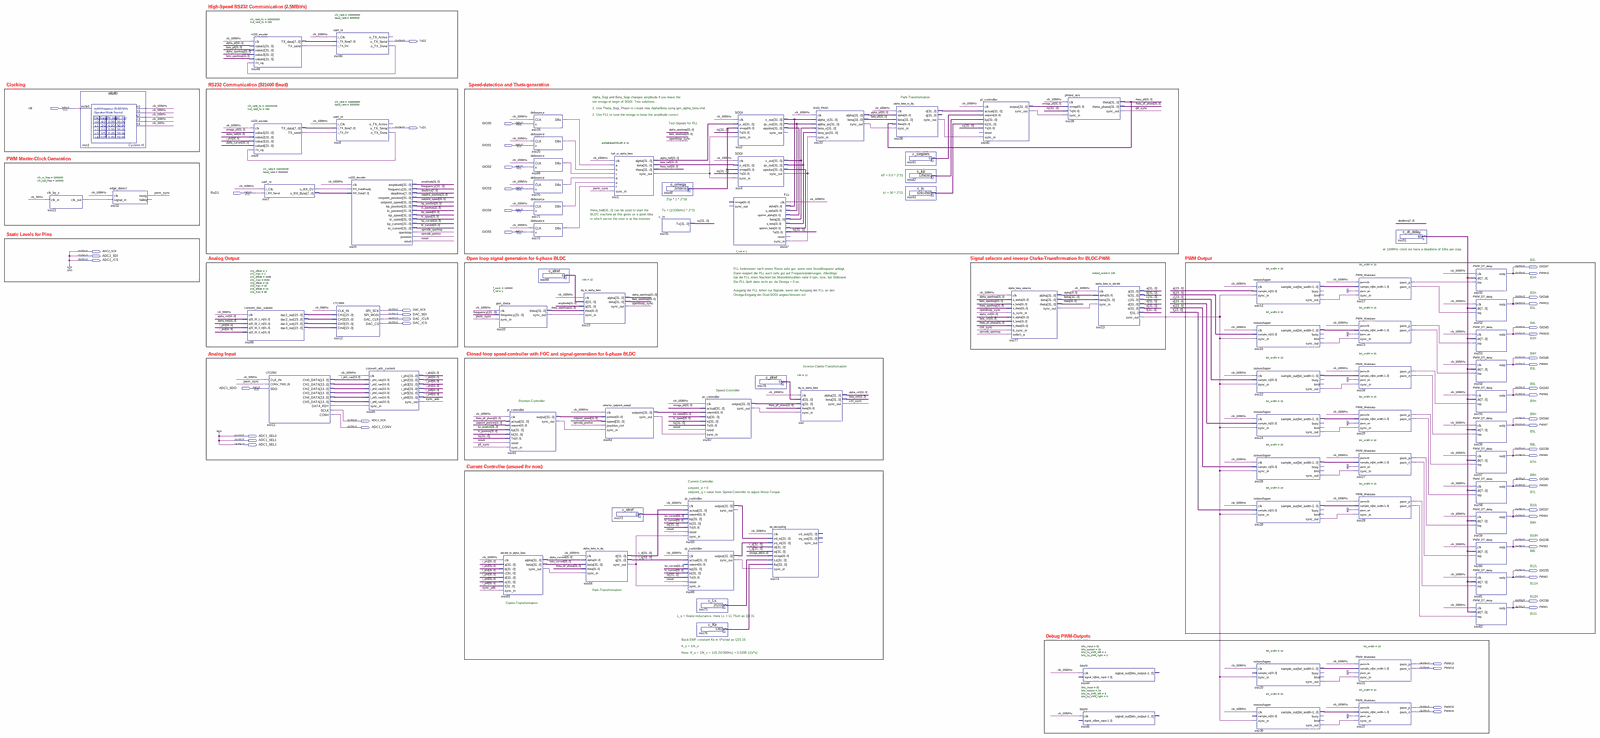
[diagram p0: schematic sheet, whole]
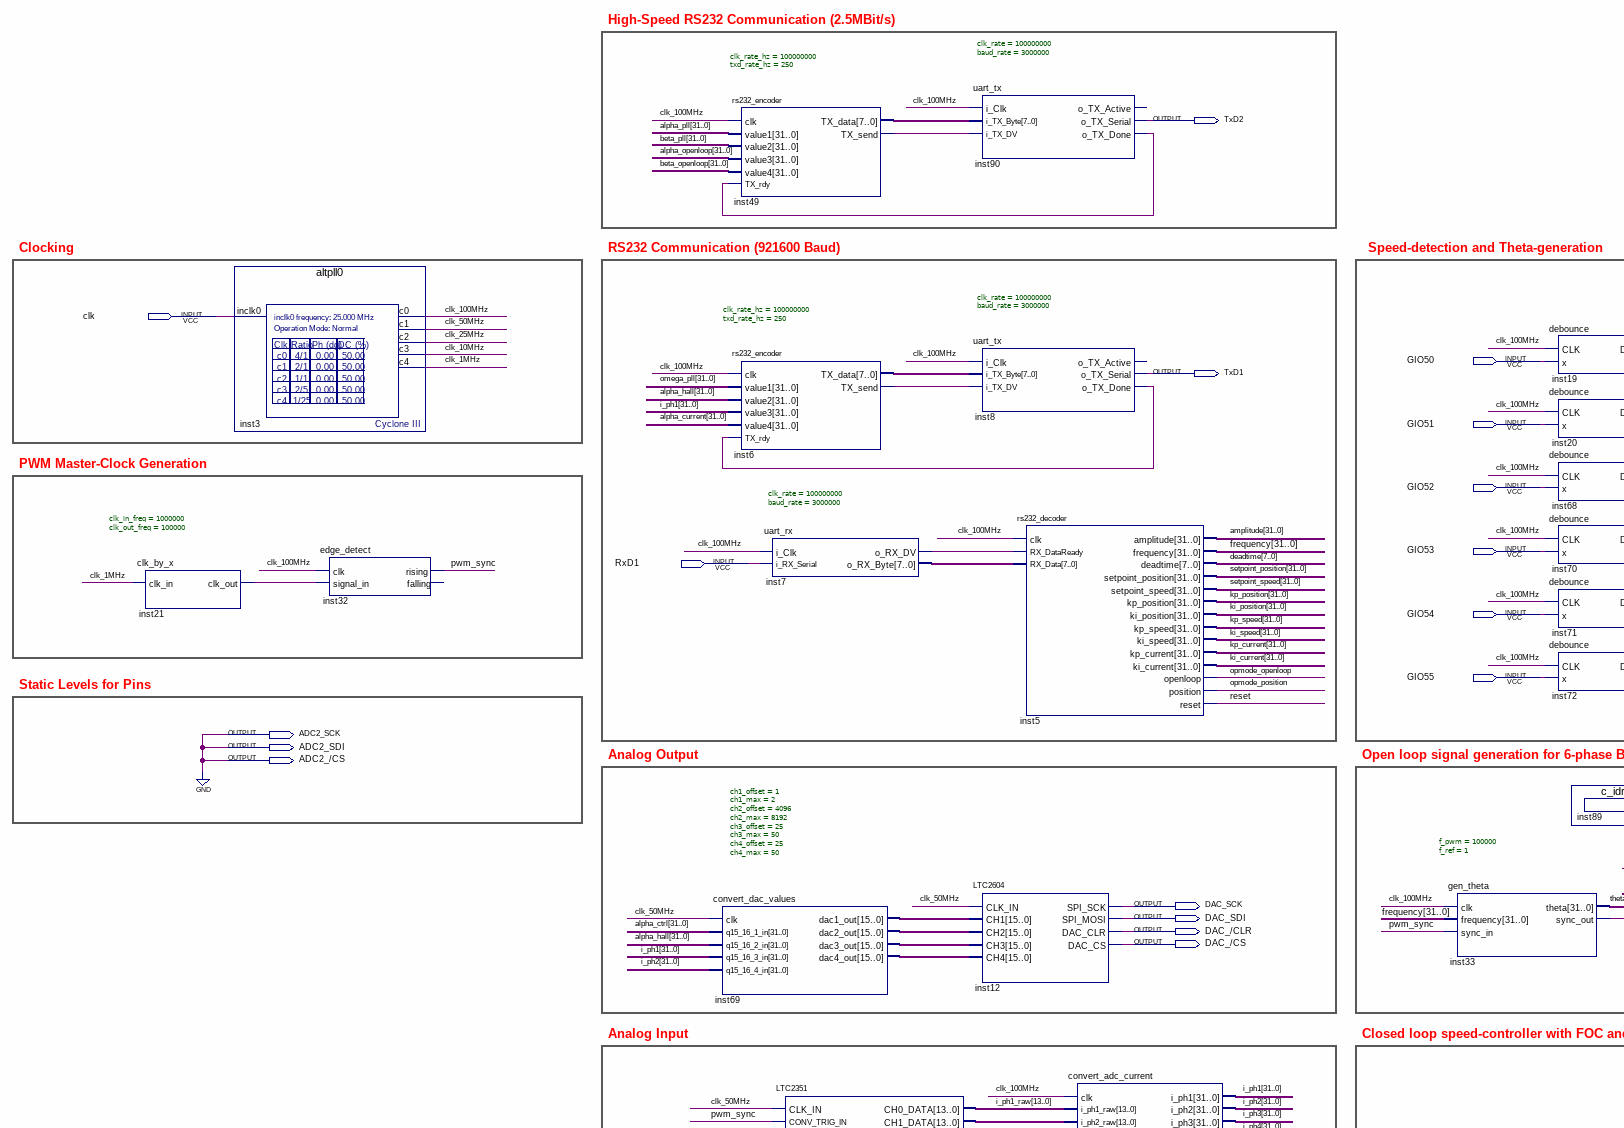
[diagram p1: schematic sheet, upper left part]
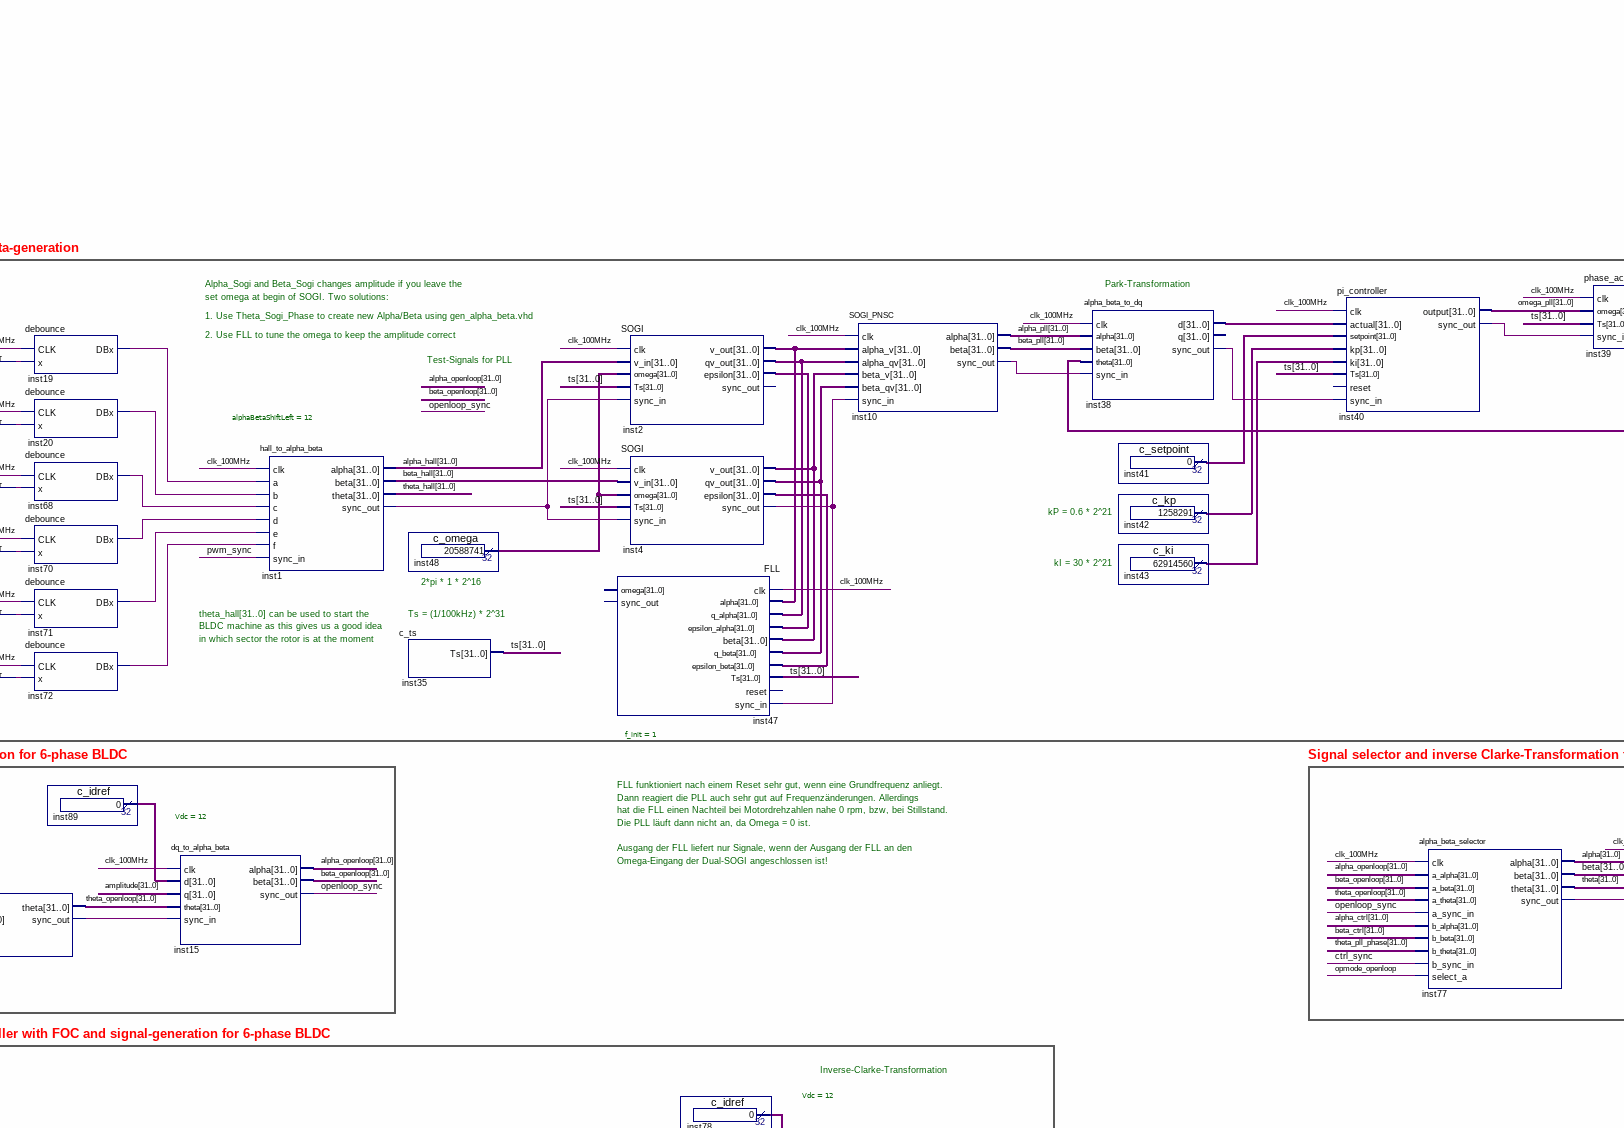
[diagram p2: schematic sheet, upper centre part]
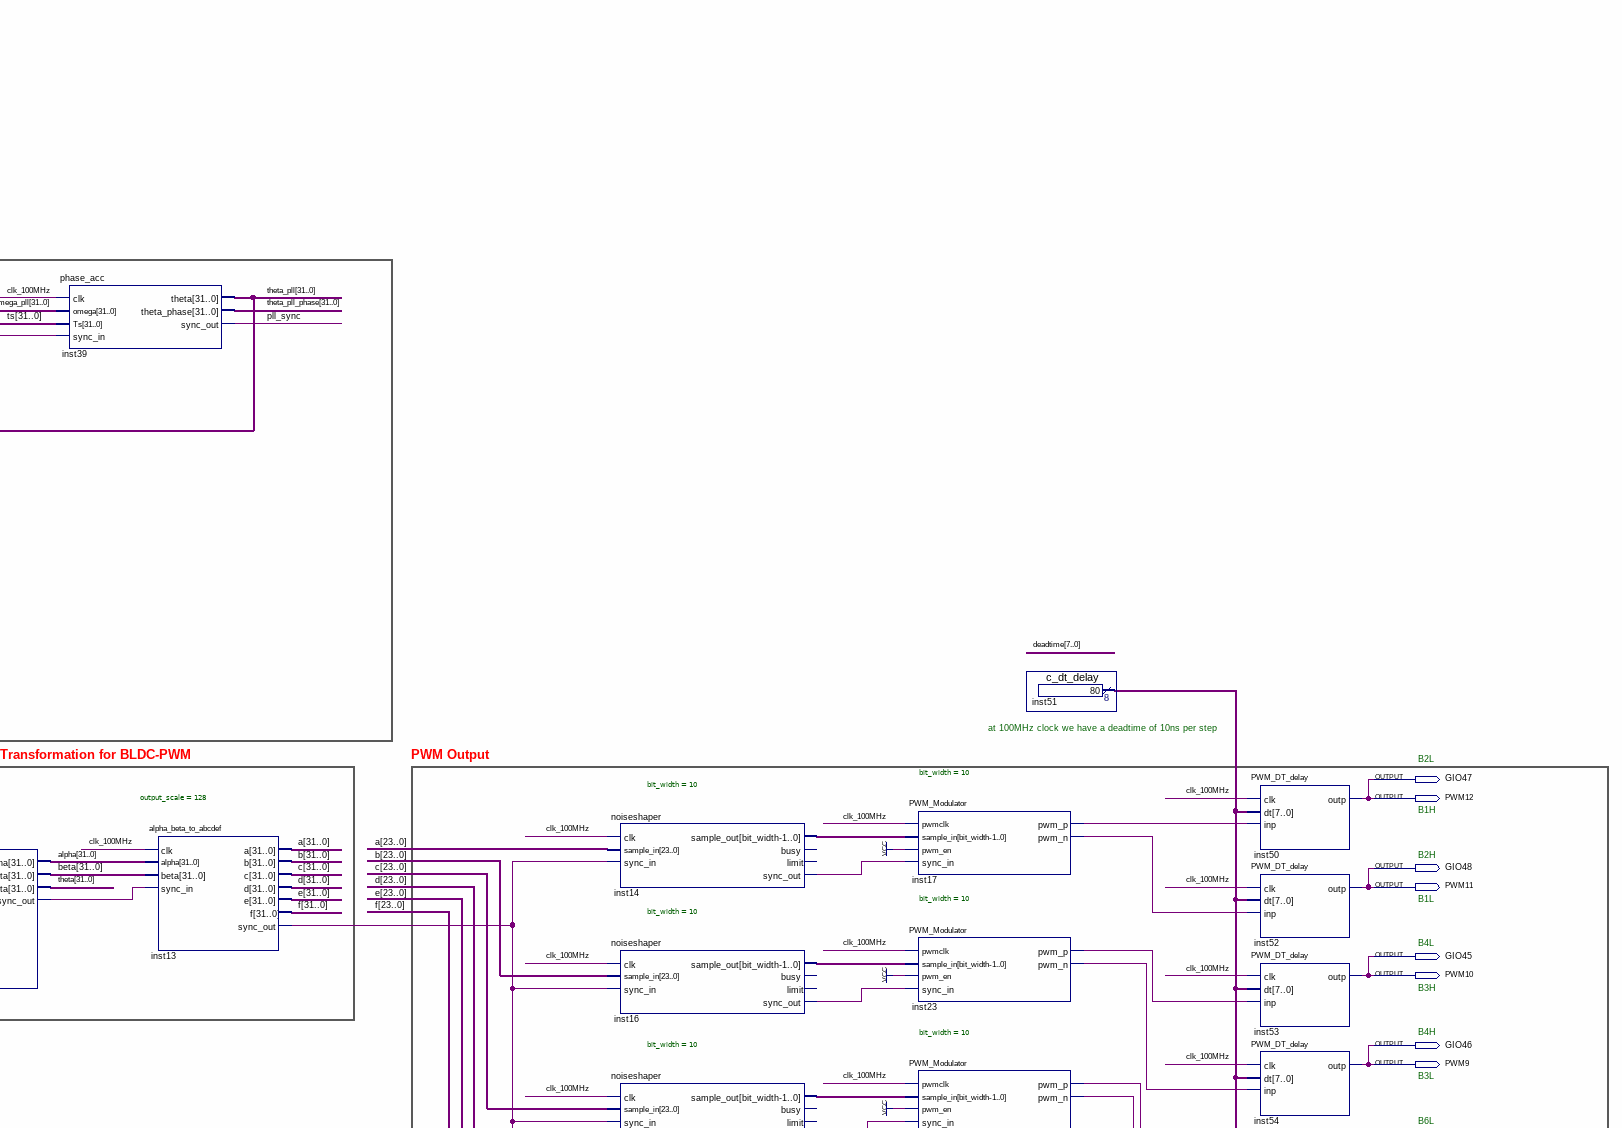
[diagram p3: schematic sheet, upper right part]
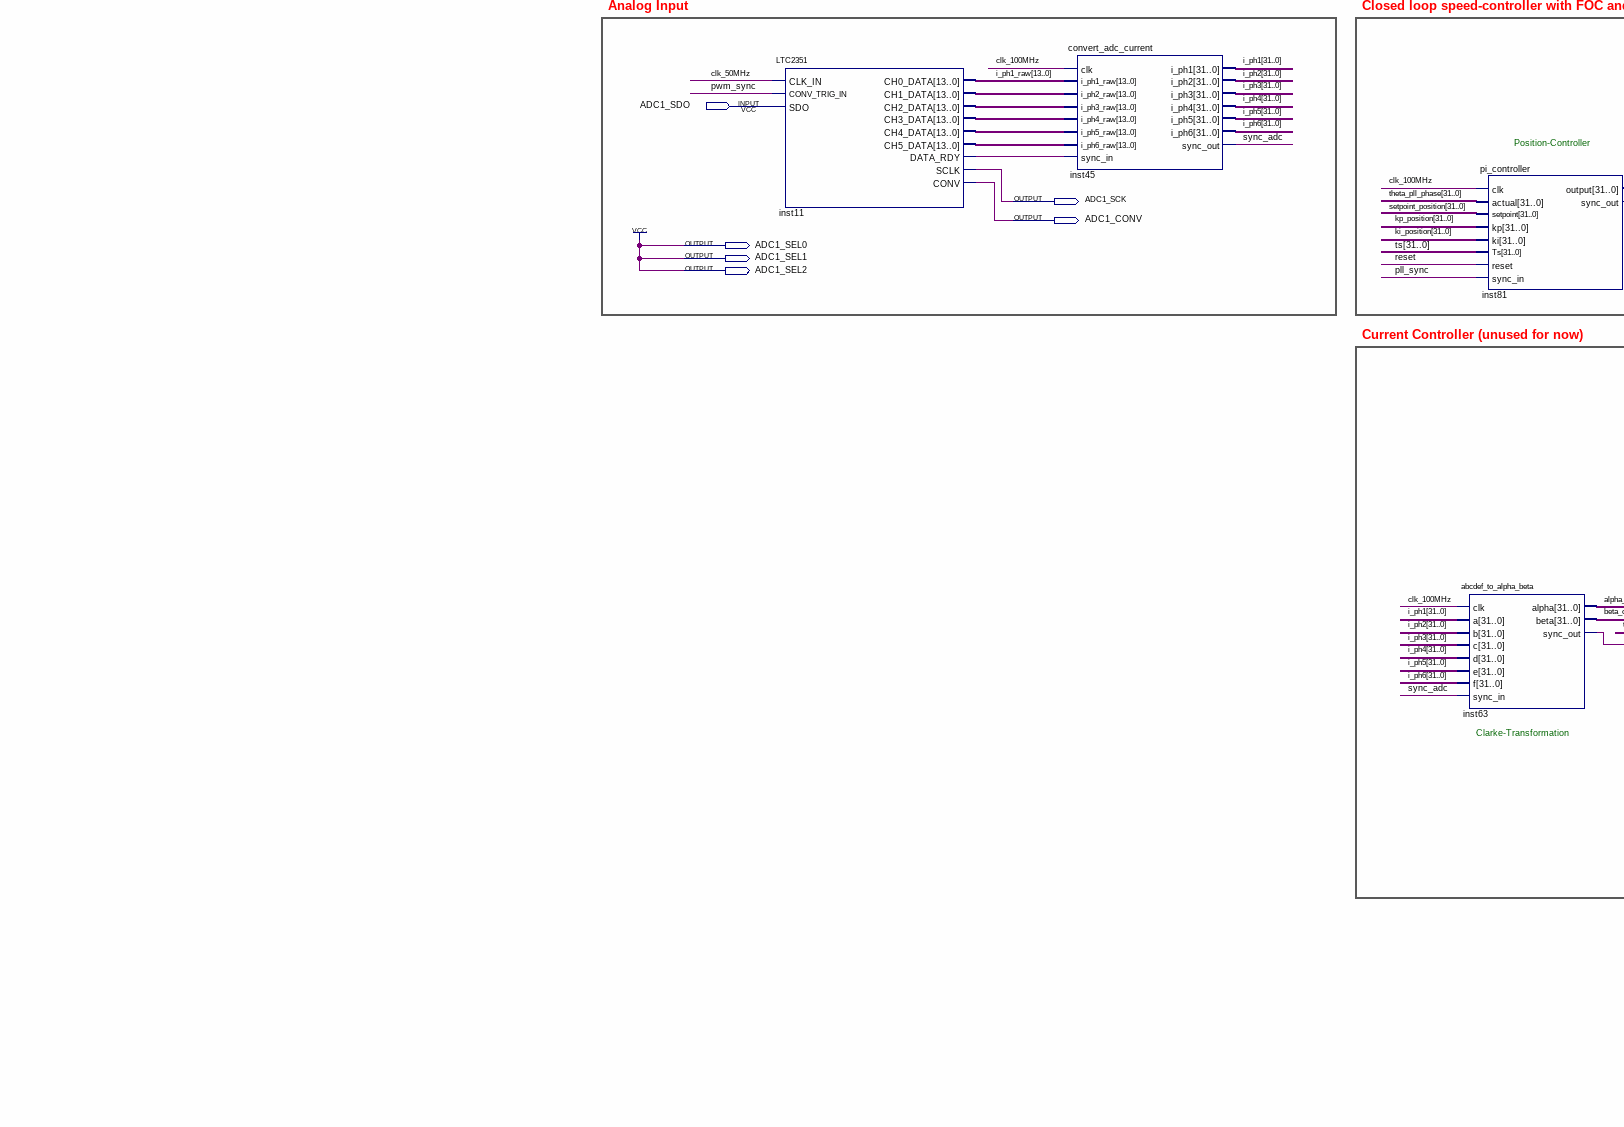
[diagram p4: schematic sheet, lower left part]
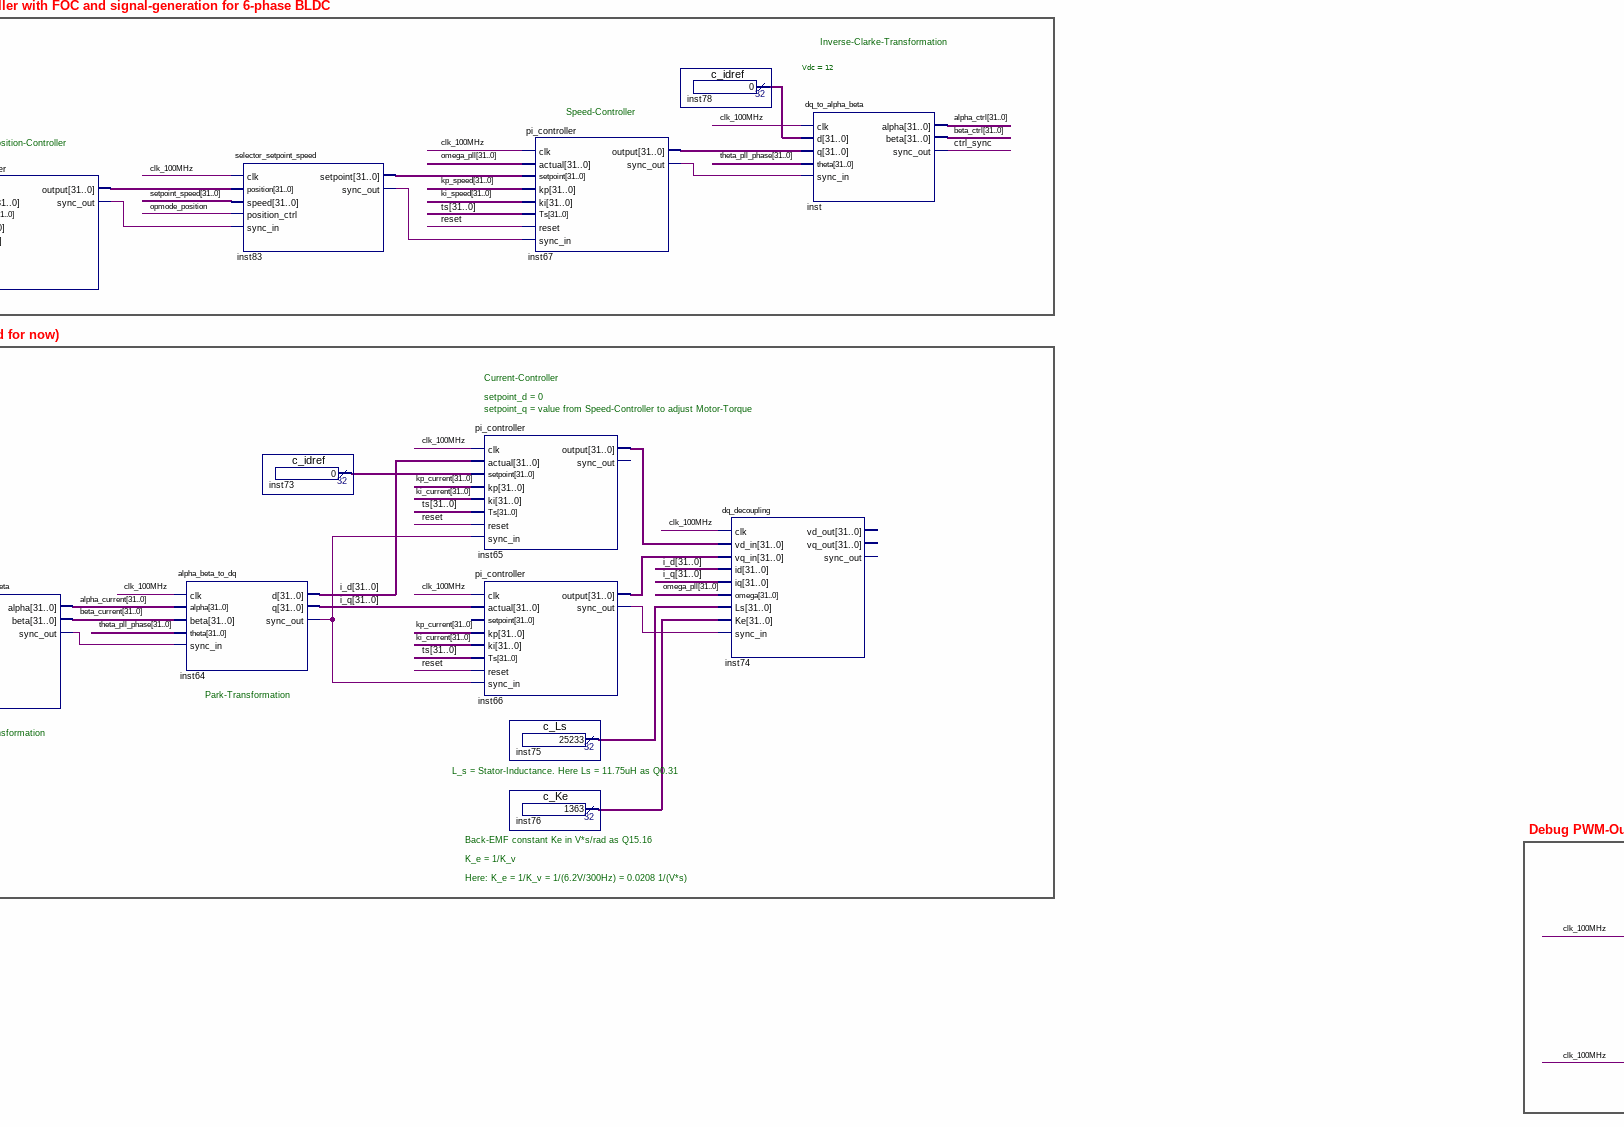
[diagram p5: schematic sheet, lower centre part]
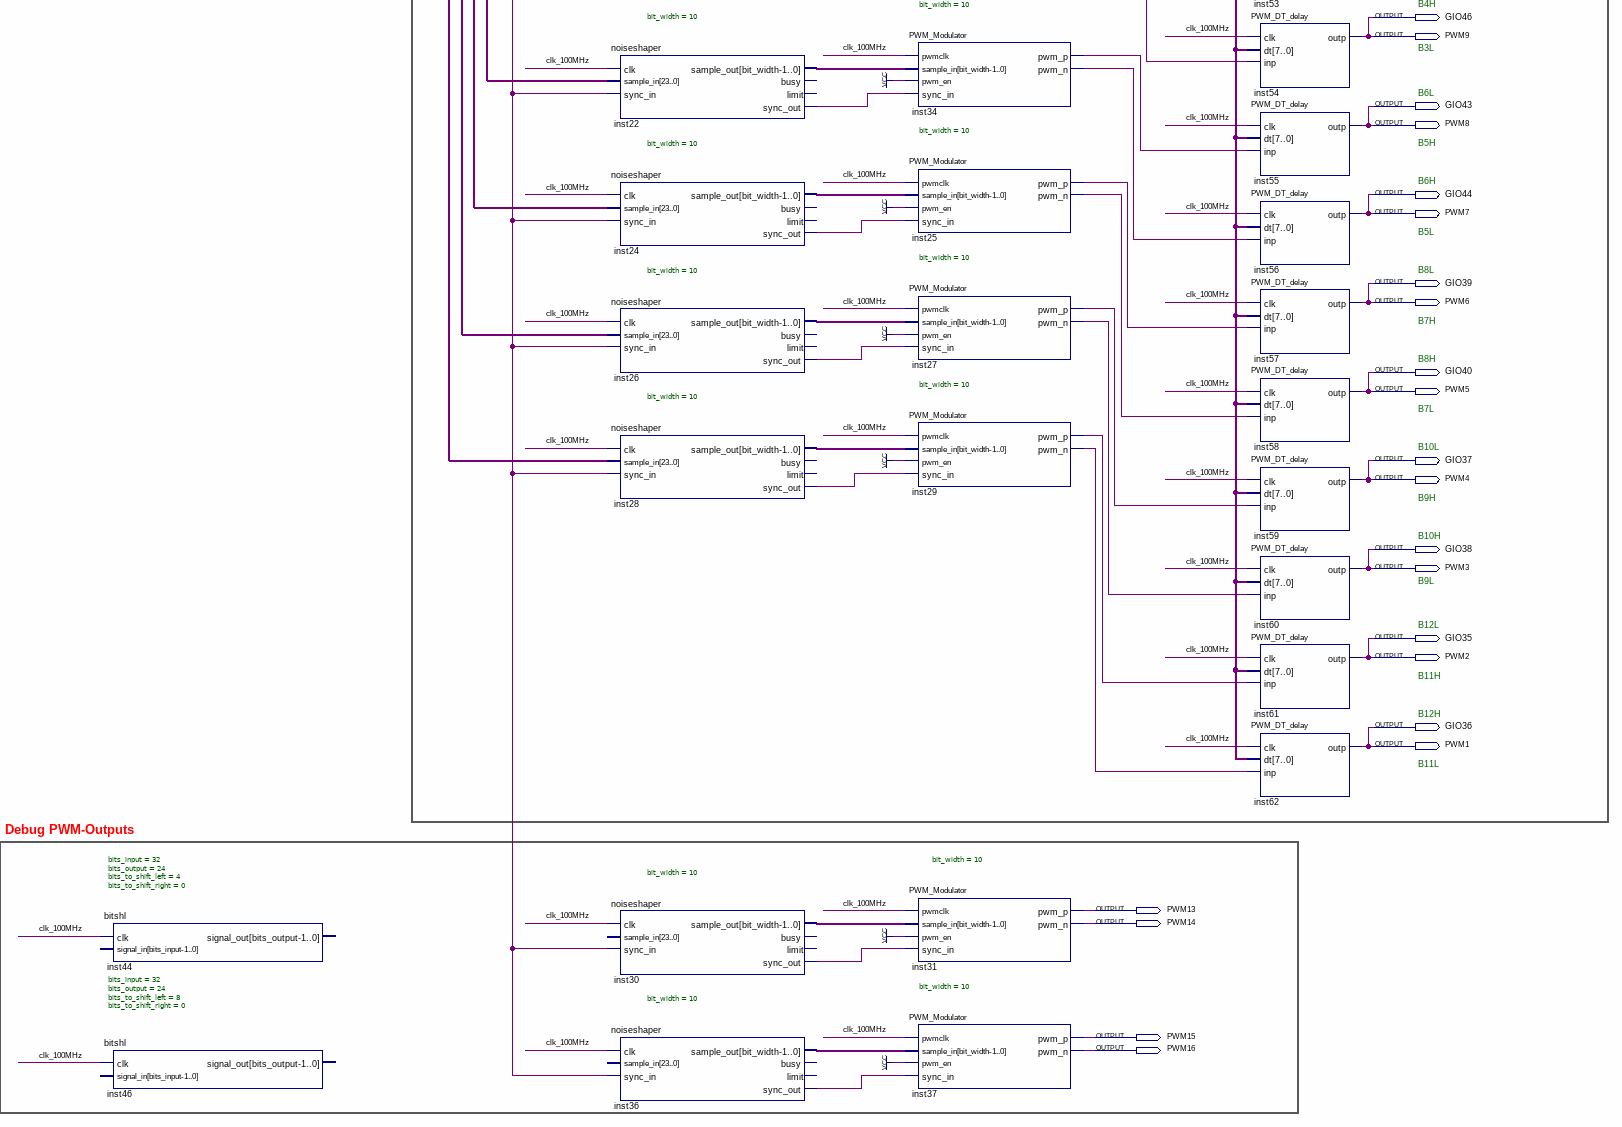
[diagram p6: schematic sheet, lower right part]
// Quartus schematic BLDC.bdf as structural Verilog: 81 symbols, 51 pins
module BLDC (
  input  clk,
  input  GIO50,
  input  GIO51,
  input  GIO52,
  input  GIO53,
  input  RxD1,
  input  GIO54,
  input  GIO55,
  input  ADC1_SDO,
  output TxD2,
  output TxD1,
  output ADC2_SCK,
  output ADC2_SDI,
  output \ADC2_/CS ,
  output GIO47,
  output PWM12,
  output GIO48,
  output PWM11,
  output DAC_SCK,
  output DAC_SDI,
  output \DAC_/CLR ,
  output \DAC_/CS ,
  output GIO45,
  output PWM10,
  output GIO46,
  output PWM9,
  output GIO43,
  output PWM8,
  output GIO44,
  output ADC1_SCK,
  output PWM7,
  output ADC1_CONV,
  output ADC1_SEL0,
  output ADC1_SEL1,
  output ADC1_SEL2,
  output GIO39,
  output PWM6,
  output GIO40,
  output PWM5,
  output GIO37,
  output PWM4,
  output GIO38,
  output PWM3,
  output GIO35,
  output PWM2,
  output GIO36,
  output PWM1,
  output PWM13,
  output PWM14,
  output PWM15,
  output PWM16
);

  wire clk_1MHz, clk_10MHz, clk_25MHz, clk_50MHz, clk_100MHz, ctrl_sync, inst1_sync_out, inst4_sync_out,
       inst6_tx_send, inst7_o_rx_dv, inst8_o_tx_done, inst10_sync_out, inst11_data_rdy, inst13_sync_out,
       inst14_sync_out, inst16_sync_out, inst17_pwm_n, inst17_pwm_p, inst19_dbx, inst20_dbx, inst21_clk_out,
       inst22_sync_out, inst23_pwm_n, inst23_pwm_p, inst24_sync_out, inst25_pwm_n, inst25_pwm_p,
       inst26_sync_out, inst27_pwm_n, inst27_pwm_p, inst28_sync_out, inst29_pwm_n, inst29_pwm_p,
       inst30_sync_out, inst33_sync_out, inst34_pwm_n, inst34_pwm_p, inst36_sync_out, inst38_sync_out,
       inst40_sync_out, inst49_tx_send, inst63_sync_out, inst64_sync_out, inst66_sync_out, inst67_sync_out,
       inst68_dbx, inst70_dbx, inst71_dbx, inst72_dbx, inst77_sync_out, inst81_sync_out, inst83_sync_out,
       inst90_o_tx_done, openloop_sync, opmode_openloop, opmode_position, pll_sync, pwm_sync, reset, sync_adc;
  wire [7:0] deadtime, inst6_tx_data, inst7_o_rx_byte, inst49_tx_data, inst51_result;
  wire [9:0] inst14_sample_out, inst16_sample_out, inst22_sample_out, inst24_sample_out, inst26_sample_out,
       inst28_sample_out, inst30_sample_out, inst36_sample_out;
  wire [13:0] i_ph1_raw, inst11_ch1_data, inst11_ch2_data, inst11_ch3_data, inst11_ch4_data, inst11_ch5_data;
  wire [15:0] inst69_dac1_out, inst69_dac2_out, inst69_dac3_out, inst69_dac4_out;
  wire [31:0] a, alpha, alpha_ctrl, alpha_current, alpha_hall, alpha_openloop, alpha_pll, amplitude, b, beta,
       beta_ctrl, beta_current, beta_hall, beta_openloop, beta_pll, c, d, e, f, frequency, i_d, i_ph1, i_ph2,
       i_ph3, i_ph4, i_ph5, i_ph6, i_q, inst2_epsilon, inst2_qv_out, inst2_v_out, inst4_epsilon,
       inst4_qv_out, inst4_v_out, inst38_d, inst41_result, inst42_result, inst43_result, inst48_result,
       inst65_output, inst66_output, inst67_output, inst73_result, inst75_result, inst76_result,
       inst78_result, inst81_output, inst83_setpoint, inst89_result, ki_current, ki_position, ki_speed,
       kp_current, kp_position, kp_speed, omega_pll, setpoint_position, setpoint_speed, theta, theta_hall,
       theta_openloop, theta_pll, theta_pll_phase, ts;

  clk_by_x #(.clk_in_freq(1000000), .clk_out_freq(100000)) inst21 (.clk_in(clk_1MHz), .clk_out(inst21_clk_out));
  altpll0 inst3 (.inclk0(clk), .c0(clk_100MHz), .c1(clk_50MHz), .c2(clk_25MHz), .c3(clk_10MHz), .c4(clk_1MHz));
  edge_detect inst32 (.clk(clk_100MHz), .signal_in(inst21_clk_out), .rising(pwm_sync));  // open: falling
  rs232_encoder #(.clk_rate_hz(100000000), .txd_rate_hz(250)) inst49 (
    .clk(clk_100MHz), .value1(alpha_pll), .value2(beta_pll), .value3(alpha_openloop), .value4(beta_openloop),
    .TX_rdy(inst90_o_tx_done), .TX_data(inst49_tx_data), .TX_send(inst49_tx_send));
  rs232_encoder #(.clk_rate_hz(100000000), .txd_rate_hz(250)) inst6 (
    .clk(clk_100MHz), .value1(omega_pll), .value2(alpha_hall), .value3(i_ph1), .value4(alpha_current),
    .TX_rdy(inst8_o_tx_done), .TX_data(inst6_tx_data), .TX_send(inst6_tx_send));
  convert_dac_values #(.ch1_offset(1), .ch1_max(2), .ch2_offset(4096), .ch2_max(8192), .ch3_offset(25), .ch3_max(50), .ch4_offset(25), .ch4_max(50)) inst69 (
    .clk(clk_50MHz), .q15_16_1_in(alpha_ctrl), .q15_16_2_in(alpha_hall), .q15_16_3_in(i_ph1),
    .q15_16_4_in(i_ph2), .dac1_out(inst69_dac1_out), .dac2_out(inst69_dac2_out), .dac3_out(inst69_dac3_out),
    .dac4_out(inst69_dac4_out));
  uart_rx #(.clk_rate(100000000), .baud_rate(3000000)) inst7 (
    .i_Clk(clk_100MHz), .i_RX_Serial(RxD1), .o_RX_DV(inst7_o_rx_dv), .o_RX_Byte(inst7_o_rx_byte));
  LTC2351 inst11 (
    .CLK_IN(clk_50MHz), .CONV_TRIG_IN(pwm_sync), .SDO(ADC1_SDO), .CH0_DATA(i_ph1_raw),
    .CH1_DATA(inst11_ch1_data), .CH2_DATA(inst11_ch2_data), .CH3_DATA(inst11_ch3_data),
    .CH4_DATA(inst11_ch4_data), .CH5_DATA(inst11_ch5_data), .DATA_RDY(inst11_data_rdy), .SCLK(ADC1_SCK),
    .CONV(ADC1_CONV));
  uart_tx #(.clk_rate(100000000), .baud_rate(3000000)) inst90 (
    .i_Clk(clk_100MHz), .i_TX_Byte(inst49_tx_data), .i_TX_DV(inst49_tx_send), .o_TX_Serial(TxD2),
    .o_TX_Done(inst90_o_tx_done));  // open: o_TX_Active
  uart_tx #(.clk_rate(100000000), .baud_rate(3000000)) inst8 (
    .i_Clk(clk_100MHz), .i_TX_Byte(inst6_tx_data), .i_TX_DV(inst6_tx_send), .o_TX_Serial(TxD1),
    .o_TX_Done(inst8_o_tx_done));  // open: o_TX_Active
  LTC2604 inst12 (
    .CLK_IN(clk_50MHz), .CH1(inst69_dac1_out), .CH2(inst69_dac2_out), .CH3(inst69_dac3_out),
    .CH4(inst69_dac4_out), .SPI_SCK(DAC_SCK), .SPI_MOSI(DAC_SDI), .DAC_CLR(\DAC_/CLR ), .DAC_CS(\DAC_/CS ));
  rs232_decoder inst5 (
    .clk(clk_100MHz), .RX_DataReady(inst7_o_rx_dv), .RX_Data(inst7_o_rx_byte), .amplitude(amplitude),
    .frequency(frequency), .deadtime(deadtime), .setpoint_position(setpoint_position),
    .setpoint_speed(setpoint_speed), .kp_position(kp_position), .ki_position(ki_position),
    .kp_speed(kp_speed), .ki_speed(ki_speed), .kp_current(kp_current), .ki_current(ki_current),
    .openloop(opmode_openloop), .position(opmode_position), .reset(reset));
  convert_adc_current inst45 (
    .clk(clk_100MHz), .i_ph1_raw(i_ph1_raw), .i_ph2_raw(inst11_ch1_data), .i_ph3_raw(inst11_ch2_data),
    .i_ph4_raw(inst11_ch3_data), .i_ph5_raw(inst11_ch4_data), .i_ph6_raw(inst11_ch5_data),
    .sync_in(inst11_data_rdy), .i_ph1(i_ph1), .i_ph2(i_ph2), .i_ph3(i_ph3), .i_ph4(i_ph4), .i_ph5(i_ph5),
    .i_ph6(i_ph6), .sync_out(sync_adc));
  gen_theta #(.f_pwm(100000), .f_ref(1)) inst33 (
    .clk(clk_100MHz), .frequency(frequency), .sync_in(pwm_sync), .theta(theta_openloop),
    .sync_out(inst33_sync_out));
  pi_controller inst81 (
    .clk(clk_100MHz), .actual(theta_pll_phase), .setpoint(setpoint_position), .kp(kp_position),
    .ki(ki_position), .Ts(ts), .reset(reset), .sync_in(pll_sync), .\output (inst81_output),
    .sync_out(inst81_sync_out));
  abcdef_to_alpha_beta inst63 (
    .clk(clk_100MHz), .a(i_ph1), .b(i_ph2), .c(i_ph3), .d(i_ph4), .e(i_ph5), .f(i_ph6), .sync_in(sync_adc),
    .alpha(alpha_current), .beta(beta_current), .sync_out(inst63_sync_out));
  debounce inst19 (.CLK(clk_100MHz), .x(GIO50), .DBx(inst19_dbx));
  debounce inst20 (.CLK(clk_100MHz), .x(GIO51), .DBx(inst20_dbx));
  debounce inst68 (.CLK(clk_100MHz), .x(GIO52), .DBx(inst68_dbx));
  debounce inst70 (.CLK(clk_100MHz), .x(GIO53), .DBx(inst70_dbx));
  debounce inst71 (.CLK(clk_100MHz), .x(GIO54), .DBx(inst71_dbx));
  debounce inst72 (.CLK(clk_100MHz), .x(GIO55), .DBx(inst72_dbx));
  c_idref inst89 (.result(inst89_result));
  dq_to_alpha_beta #(.Vdc(12)) inst15 (
    .clk(clk_100MHz), .d(inst89_result), .q(amplitude), .theta(theta_openloop), .sync_in(inst33_sync_out),
    .alpha(alpha_openloop), .beta(beta_openloop), .sync_out(openloop_sync));
  alpha_beta_to_dq inst64 (
    .clk(clk_100MHz), .alpha(alpha_current), .beta(beta_current), .theta(theta_pll_phase),
    .sync_in(inst63_sync_out), .d(i_d), .q(i_q), .sync_out(inst64_sync_out));
  hall_to_alpha_beta #(.alphaBetaShiftLeft(12)) inst1 (
    .clk(clk_100MHz), .a(inst19_dbx), .b(inst20_dbx), .c(inst68_dbx), .d(inst70_dbx), .e(inst71_dbx),
    .f(inst72_dbx), .sync_in(pwm_sync), .alpha(alpha_hall), .beta(beta_hall), .theta(theta_hall),
    .sync_out(inst1_sync_out));
  selector_setpoint_speed inst83 (
    .clk(clk_100MHz), .position(inst81_output), .speed(setpoint_speed), .position_ctrl(opmode_position),
    .sync_in(inst81_sync_out), .setpoint(inst83_setpoint), .sync_out(inst83_sync_out));
  c_idref inst73 (.result(inst73_result));
  c_omega inst48 (.result(inst48_result));
  c_ts inst35 (.Ts(ts));
  pi_controller inst65 (
    .clk(clk_100MHz), .actual(i_d), .setpoint(inst73_result), .kp(kp_current), .ki(ki_current), .Ts(ts),
    .reset(reset), .sync_in(inst64_sync_out), .\output (inst65_output));  // open: sync_out
  pi_controller inst66 (
    .clk(clk_100MHz), .actual(i_q), .kp(kp_current), .ki(ki_current), .Ts(ts), .reset(reset),
    .sync_in(inst64_sync_out), .\output (inst66_output), .sync_out(inst66_sync_out));  // open: setpoint
  pi_controller inst67 (
    .clk(clk_100MHz), .actual(omega_pll), .setpoint(inst83_setpoint), .kp(kp_speed), .ki(ki_speed), .Ts(ts),
    .reset(reset), .sync_in(inst83_sync_out), .\output (inst67_output), .sync_out(inst67_sync_out));
  c_Ls inst75 (.result(inst75_result));
  c_Ke inst76 (.result(inst76_result));
  SOGI inst2 (
    .clk(clk_100MHz), .v_in(alpha_hall), .omega(inst48_result), .Ts(ts), .sync_in(inst1_sync_out),
    .v_out(inst2_v_out), .qv_out(inst2_qv_out), .epsilon(inst2_epsilon));  // open: sync_out
  SOGI inst4 (
    .clk(clk_100MHz), .v_in(beta_hall), .omega(inst48_result), .Ts(ts), .sync_in(inst1_sync_out),
    .v_out(inst4_v_out), .qv_out(inst4_qv_out), .epsilon(inst4_epsilon), .sync_out(inst4_sync_out));
  FLL #(.f_init(1)) inst47 (
    .clk(clk_100MHz), .alpha(inst2_v_out), .q_alpha(inst2_qv_out), .epsilon_alpha(inst2_epsilon),
    .beta(inst4_v_out), .q_beta(inst4_qv_out), .epsilon_beta(inst4_epsilon), .Ts(ts), .sync_in(inst4_sync_out));  // open: reset, omega, sync_out
  c_idref inst78 (.result(inst78_result));
  dq_decoupling inst74 (
    .clk(clk_100MHz), .vd_in(inst65_output), .vq_in(inst66_output), .id(i_d), .iq(i_q), .omega(omega_pll),
    .Ls(inst75_result), .Ke(inst76_result), .sync_in(inst66_sync_out));  // open: vd_out, vq_out, sync_out
  dq_to_alpha_beta #(.Vdc(12)) inst (
    .clk(clk_100MHz), .d(inst78_result), .q(inst67_output), .theta(theta_pll_phase),
    .sync_in(inst67_sync_out), .alpha(alpha_ctrl), .beta(beta_ctrl), .sync_out(ctrl_sync));
  SOGI_PNSC inst10 (
    .clk(clk_100MHz), .alpha_v(inst2_v_out), .alpha_qv(inst2_qv_out), .beta_v(inst4_v_out),
    .beta_qv(inst4_qv_out), .sync_in(inst4_sync_out), .alpha(alpha_pll), .beta(beta_pll),
    .sync_out(inst10_sync_out));
  alpha_beta_to_dq inst38 (
    .clk(clk_100MHz), .alpha(alpha_pll), .beta(beta_pll), .theta(theta_pll), .sync_in(inst10_sync_out),
    .d(inst38_d), .sync_out(inst38_sync_out));  // open: q
  c_setpoint inst41 (.result(inst41_result));
  c_kp inst42 (.result(inst42_result));
  c_ki inst43 (.result(inst43_result));
  pi_controller inst40 (
    .clk(clk_100MHz), .actual(inst38_d), .setpoint(inst41_result), .kp(inst42_result), .ki(inst43_result),
    .Ts(ts), .sync_in(inst38_sync_out), .\output (omega_pll), .sync_out(inst40_sync_out));  // open: reset
  alpha_beta_selector inst77 (
    .clk(clk_100MHz), .a_alpha(alpha_openloop), .a_beta(beta_openloop), .a_theta(theta_openloop),
    .a_sync_in(openloop_sync), .b_alpha(alpha_ctrl), .b_beta(beta_ctrl), .b_theta(theta_pll_phase),
    .b_sync_in(ctrl_sync), .select_a(opmode_openloop), .alpha(alpha), .beta(beta), .theta(theta),
    .sync_out(inst77_sync_out));
  phase_acc inst39 (
    .clk(clk_100MHz), .omega(omega_pll), .Ts(ts), .sync_in(inst40_sync_out), .theta(theta_pll),
    .theta_phase(theta_pll_phase), .sync_out(pll_sync));
  bitshl #(.bits_input(32), .bits_output(24), .bits_to_shift_left(4), .bits_to_shift_right(0)) inst44 (.clk(clk_100MHz));  // open: signal_in, signal_out
  bitshl #(.bits_input(32), .bits_output(24), .bits_to_shift_left(8), .bits_to_shift_right(0)) inst46 (.clk(clk_100MHz));  // open: signal_in, signal_out
  alpha_beta_to_abcdef #(.output_scale(128)) inst13 (
    .clk(clk_100MHz), .alpha(alpha), .beta(beta), .sync_in(inst77_sync_out), .a(a), .b(b), .c(c), .d(d),
    .e(e), .f(f), .sync_out(inst13_sync_out));
  noiseshaper #(.bit_width(10)) inst14 (
    .clk(clk_100MHz), .sample_in(a[23:0]), .sync_in(inst13_sync_out), .sample_out(inst14_sample_out),
    .sync_out(inst14_sync_out));  // open: busy, limit
  noiseshaper #(.bit_width(10)) inst16 (
    .clk(clk_100MHz), .sample_in(b[23:0]), .sync_in(inst13_sync_out), .sample_out(inst16_sample_out),
    .sync_out(inst16_sync_out));  // open: busy, limit
  noiseshaper #(.bit_width(10)) inst22 (
    .clk(clk_100MHz), .sample_in(c[23:0]), .sync_in(inst13_sync_out), .sample_out(inst22_sample_out),
    .sync_out(inst22_sync_out));  // open: busy, limit
  noiseshaper #(.bit_width(10)) inst24 (
    .clk(clk_100MHz), .sample_in(d[23:0]), .sync_in(inst13_sync_out), .sample_out(inst24_sample_out),
    .sync_out(inst24_sync_out));  // open: busy, limit
  noiseshaper #(.bit_width(10)) inst26 (
    .clk(clk_100MHz), .sample_in(e[23:0]), .sync_in(inst13_sync_out), .sample_out(inst26_sample_out),
    .sync_out(inst26_sync_out));  // open: busy, limit
  noiseshaper #(.bit_width(10)) inst28 (
    .clk(clk_100MHz), .sample_in(f[23:0]), .sync_in(inst13_sync_out), .sample_out(inst28_sample_out),
    .sync_out(inst28_sync_out));  // open: busy, limit
  noiseshaper #(.bit_width(10)) inst30 (
    .clk(clk_100MHz), .sync_in(inst13_sync_out), .sample_out(inst30_sample_out), .sync_out(inst30_sync_out));  // open: sample_in, busy, limit
  noiseshaper #(.bit_width(10)) inst36 (
    .clk(clk_100MHz), .sync_in(inst13_sync_out), .sample_out(inst36_sample_out), .sync_out(inst36_sync_out));  // open: sample_in, busy, limit
  PWM_Modulator #(.bit_width(10)) inst17 (
    .pwmclk(clk_100MHz), .sample_in(inst14_sample_out), .pwm_en(1'b1), .sync_in(inst14_sync_out),
    .pwm_p(inst17_pwm_p), .pwm_n(inst17_pwm_n));
  PWM_Modulator #(.bit_width(10)) inst23 (
    .pwmclk(clk_100MHz), .sample_in(inst16_sample_out), .pwm_en(1'b1), .sync_in(inst16_sync_out),
    .pwm_p(inst23_pwm_p), .pwm_n(inst23_pwm_n));
  PWM_Modulator #(.bit_width(10)) inst34 (
    .pwmclk(clk_100MHz), .sample_in(inst22_sample_out), .pwm_en(1'b1), .sync_in(inst22_sync_out),
    .pwm_p(inst34_pwm_p), .pwm_n(inst34_pwm_n));
  PWM_Modulator #(.bit_width(10)) inst25 (
    .pwmclk(clk_100MHz), .sample_in(inst24_sample_out), .pwm_en(1'b1), .sync_in(inst24_sync_out),
    .pwm_p(inst25_pwm_p), .pwm_n(inst25_pwm_n));
  PWM_Modulator #(.bit_width(10)) inst27 (
    .pwmclk(clk_100MHz), .sample_in(inst26_sample_out), .pwm_en(1'b1), .sync_in(inst26_sync_out),
    .pwm_p(inst27_pwm_p), .pwm_n(inst27_pwm_n));
  PWM_Modulator #(.bit_width(10)) inst29 (
    .pwmclk(clk_100MHz), .sample_in(inst28_sample_out), .pwm_en(1'b1), .sync_in(inst28_sync_out),
    .pwm_p(inst29_pwm_p), .pwm_n(inst29_pwm_n));
  PWM_Modulator #(.bit_width(10)) inst31 (
    .pwmclk(clk_100MHz), .sample_in(inst30_sample_out), .pwm_en(1'b1), .sync_in(inst30_sync_out),
    .pwm_p(PWM13), .pwm_n(PWM14));
  PWM_Modulator #(.bit_width(10)) inst37 (
    .pwmclk(clk_100MHz), .sample_in(inst36_sample_out), .pwm_en(1'b1), .sync_in(inst36_sync_out),
    .pwm_p(PWM15), .pwm_n(PWM16));
  c_dt_delay inst51 (.result(inst51_result));
  PWM_DT_delay inst50 (.clk(clk_100MHz), .dt(inst51_result), .inp(inst17_pwm_p), .outp(GIO47));
  PWM_DT_delay inst52 (.clk(clk_100MHz), .dt(inst51_result), .inp(inst17_pwm_n), .outp(GIO48));
  PWM_DT_delay inst53 (.clk(clk_100MHz), .dt(inst51_result), .inp(inst23_pwm_p), .outp(GIO45));
  PWM_DT_delay inst54 (.clk(clk_100MHz), .dt(inst51_result), .inp(inst23_pwm_n), .outp(GIO46));
  PWM_DT_delay inst55 (.clk(clk_100MHz), .dt(inst51_result), .inp(inst34_pwm_p), .outp(GIO43));
  PWM_DT_delay inst56 (.clk(clk_100MHz), .dt(inst51_result), .inp(inst34_pwm_n), .outp(GIO44));
  PWM_DT_delay inst57 (.clk(clk_100MHz), .dt(inst51_result), .inp(inst25_pwm_p), .outp(GIO39));
  PWM_DT_delay inst58 (.clk(clk_100MHz), .dt(inst51_result), .inp(inst25_pwm_n), .outp(GIO40));
  PWM_DT_delay inst59 (.clk(clk_100MHz), .dt(inst51_result), .inp(inst27_pwm_p), .outp(GIO37));
  PWM_DT_delay inst60 (.clk(clk_100MHz), .dt(inst51_result), .inp(inst27_pwm_n), .outp(GIO38));
  PWM_DT_delay inst61 (.clk(clk_100MHz), .dt(inst51_result), .inp(inst29_pwm_p), .outp(GIO35));
  PWM_DT_delay inst62 (.clk(clk_100MHz), .dt(inst51_result), .inp(inst29_pwm_n), .outp(GIO36));

  assign ADC1_SEL0 = 1'b1;
  assign ADC1_SEL1 = 1'b1;
  assign ADC1_SEL2 = 1'b1;
  assign \ADC2_/CS  = 1'b0;
  assign ADC2_SCK = 1'b0;
  assign ADC2_SDI = 1'b0;
  assign PWM1 = GIO36;
  assign PWM2 = GIO35;
  assign PWM3 = GIO38;
  assign PWM4 = GIO37;
  assign PWM5 = GIO40;
  assign PWM6 = GIO39;
  assign PWM7 = GIO44;
  assign PWM8 = GIO43;
  assign PWM9 = GIO46;
  assign PWM10 = GIO45;
  assign PWM11 = GIO48;
  assign PWM12 = GIO47;

  // Notes on the sheet:
  //   High-Speed RS232 Communication (2.5MBit/s)
  //   Clocking
  //   RS232 Communication (921600 Baud)
  //   Speed-detection and Theta-generation
  //   Alpha_Sogi and Beta_Sogi changes amplitude if you leave the 
  //   Park-Transformation
  //   set omega at begin of SOGI. Two solutions:
  //   1. Use Theta_Sogi_Phase to create new Alpha/Beta using gen_alpha_beta.vhd
  //   2. Use FLL to tune the omega to keep the amplitude correct
  //   Test-Signals for PLL
  //   PWM Master-Clock Generation
  //   kP = 0.6 * 2^21
  //   kI = 30 * 2^21
  //   2*pi * 1 * 2^16
  //   theta_hall[31..0] can be used to start the
  //   Ts = (1/100kHz) * 2^31
  //   BLDC machine as this gives us a good idea
  //   in which sector the rotor is at the moment
  //   Static Levels for Pins
  //   at 100MHz clock we have a deadtime of 10ns per step
  //   Analog Output
  //   Open loop signal generation for 6-phase BLDC
  //   Signal selector and inverse Clarke-Transformation for BLDC-PWM
  //   PWM Output
  //   B2L
  //   FLL funktioniert nach einem Reset sehr gut, wenn eine Grundfrequenz anliegt.
  //   Dann reagiert die PLL auch sehr gut auf Frequenzänderungen. Allerdings
  //   hat die FLL einen Nachteil bei Motordrehzahlen nahe 0 rpm, bzw, bei Stillstand.
  //   B1H
  //   Die PLL läuft dann nicht an, da Omega = 0 ist.
  //   Ausgang der FLL liefert nur Signale, wenn der Ausgang der FLL an den
  //   B2H
  //   Omega-Eingang der Dual-SOGI angeschlossen ist!
  //   B1L
  //   B4L
  //   B3H
  //   Analog Input
  //   Closed loop speed-controller with FOC and signal-generation for 6-phase BLDC
  //   B4H
  //   Inverse-Clarke-Transformation
  //   B3L
  //   B6L
  //   Speed-Controller
  //   Position-Controller
  //   B5H
  //   B6H
  //   B5L
  //   B8L
  //   B7H
  //   Current Controller (unused for now)
  //   B8H
  //   Current-Controller
  //   setpoint_d = 0
  //   setpoint_q = value from Speed-Controller to adjust Motor-Torque
  //   B7L
  //   B10L
  //   B9H
  //   B10H
  //   B9L
  //   B12L
  //   B11H
  //   Park-Transformation
  //   B12H
  //   Clarke-Transformation
  //   B11L
  //   L_s = Stator-Inductance. Here Ls = 11.75uH as Q0.31
  //   Debug PWM-Outputs
  //   Back-EMF constant Ke in V*s/rad as Q15.16
  //   K_e = 1/K_v
  //   Here: K_e = 1/K_v = 1/(6.2V/300Hz) = 0.0208 1/(V*s)
endmodule
